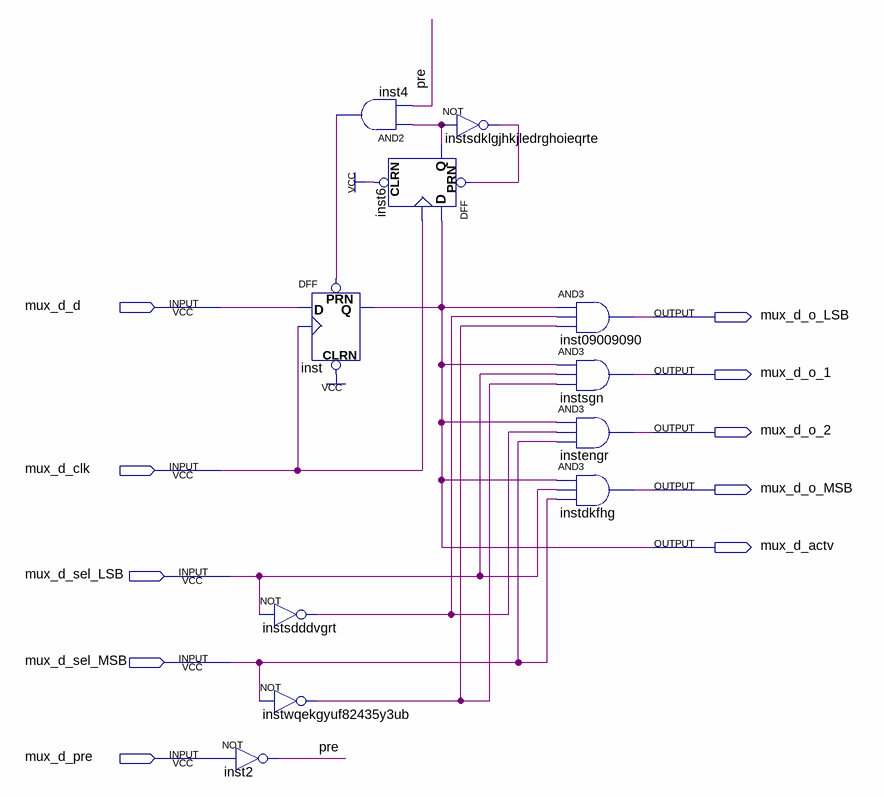
[diagram p0: schematic sheet]
// Quartus schematic loader.bdf as structural Verilog: 11 symbols, 10 pins
module loader (
  input  mux_d_d,
  input  mux_d_clk,
  input  mux_d_sel_LSB,
  input  mux_d_sel_MSB,
  input  mux_d_pre,
  output mux_d_o_LSB,
  output mux_d_o_1,
  output mux_d_o_2,
  output mux_d_o_MSB,
  output mux_d_actv
);

  wire inst4_out, inst6_q, instsdddvgrt_out, instsdklgjhkjledrghoieqrte_out, instwqekgyuf82435y3ub_out, pre;

  not instsdddvgrt (instsdddvgrt_out, mux_d_sel_LSB);
  not instwqekgyuf82435y3ub (instwqekgyuf82435y3ub_out, mux_d_sel_MSB);
  not inst2 (pre, mux_d_pre);
  and inst4 (inst4_out, inst6_q, pre);
  DFF inst (.CLRN(1'b1), .CLK(mux_d_clk), .D(mux_d_d), .PRN(inst4_out), .Q(mux_d_actv));
  DFF inst6 (.CLRN(1'b1), .CLK(mux_d_clk), .D(mux_d_actv), .PRN(instsdklgjhkjledrghoieqrte_out), .Q(inst6_q));
  not instsdklgjhkjledrghoieqrte (instsdklgjhkjledrghoieqrte_out, inst6_q);
  and inst09009090 (mux_d_o_LSB, mux_d_actv, instsdddvgrt_out, instwqekgyuf82435y3ub_out);
  and instsgn (mux_d_o_1, mux_d_actv, mux_d_sel_LSB, instwqekgyuf82435y3ub_out);
  and instengr (mux_d_o_2, mux_d_actv, instsdddvgrt_out, mux_d_sel_MSB);
  and instdkfhg (mux_d_o_MSB, mux_d_actv, mux_d_sel_LSB, mux_d_sel_MSB);
endmodule
